# Altium schematic sheet IMU.SchDoc
size A3
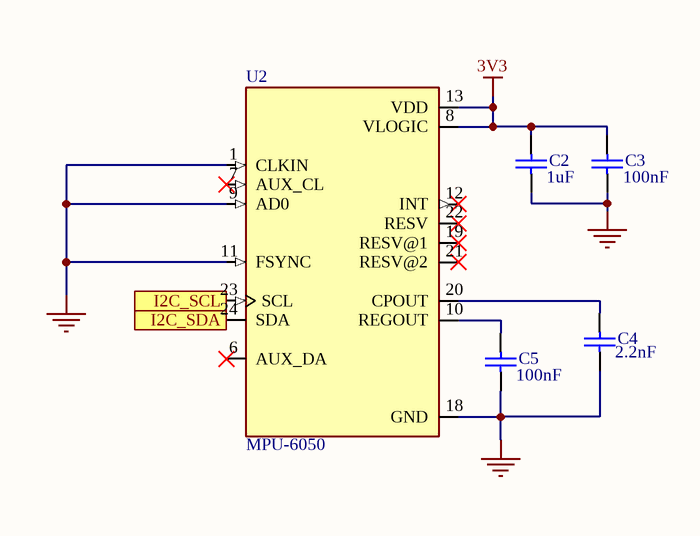
[diagram p0: IMU.SchDoc]

## Parts
C2  value 1uF  [0402]  (hidden comment: Cap)
C3  value 100nF  [0402]  (hidden comment: Cap)
C4  value 2.2nF  [0402]  (hidden comment: Cap)
C5  value 100nF  [0402]  (hidden comment: Cap)
U2  MPU-6050  [QFN50P400X400X95-24N]

## Ports
I2C_SCL, I2C_SDA

## Nets
3V3: C2.2 C3.2 U2.8(VLOGIC) U2.13(VDD)
GND: C2.1 C3.1 C4.1 C5.1 U2.1(CLKIN) U2.9(AD0) U2.11(FSYNC) U2.18(GND)
I2C_SCL: U2.23(SCL) ; port I2C_SCL
I2C_SDA: U2.24(SDA) ; port I2C_SDA
NetC4_2: C4.2 U2.20(CPOUT)
NetC5_2: C5.2 U2.10(REGOUT)

Not connected (* = marked no-connect by the designer): U2 6(AUX_DA)* 7(AUX_CL)* 12(INT)* 19(RESV@1)* 21(RESV@2)* 22(RESV)*

## Library data of the parts
U2 = MPU-6050: Accelerometer, Gyroscope, 6 Axis Sensor IÂ²C Output; MF: TDK InvenSense; Price: None; Package: VFQFN-24 TDK InvenSense; MP: MPU-6050; Value: *; Availability: Unavailable; SnapEDA_Link: https://www.snapeda.com/parts/MPU-6050/TDK%20InvenSense/view-part/4503180/?ref=snap
C2-C5 = Cap: Published: 8-Jun-2000; LatestRevisionDate: 17-Jul-2002; LatestRevisionNote: Re-released for DXP Platform.; PackageReference: RAD-0.3; Publisher: Altium Limited; PackageDescription: Radial Cap, Thru-Hole; 2 Leads; 0.3 in Pin Spacing